# Altium schematic sheet Current_measure.SchDoc: Buck Sinc Converter
size A4; Organization: UDESC; Revision: R0; SheetNumber: 5; SheetTotal: 10
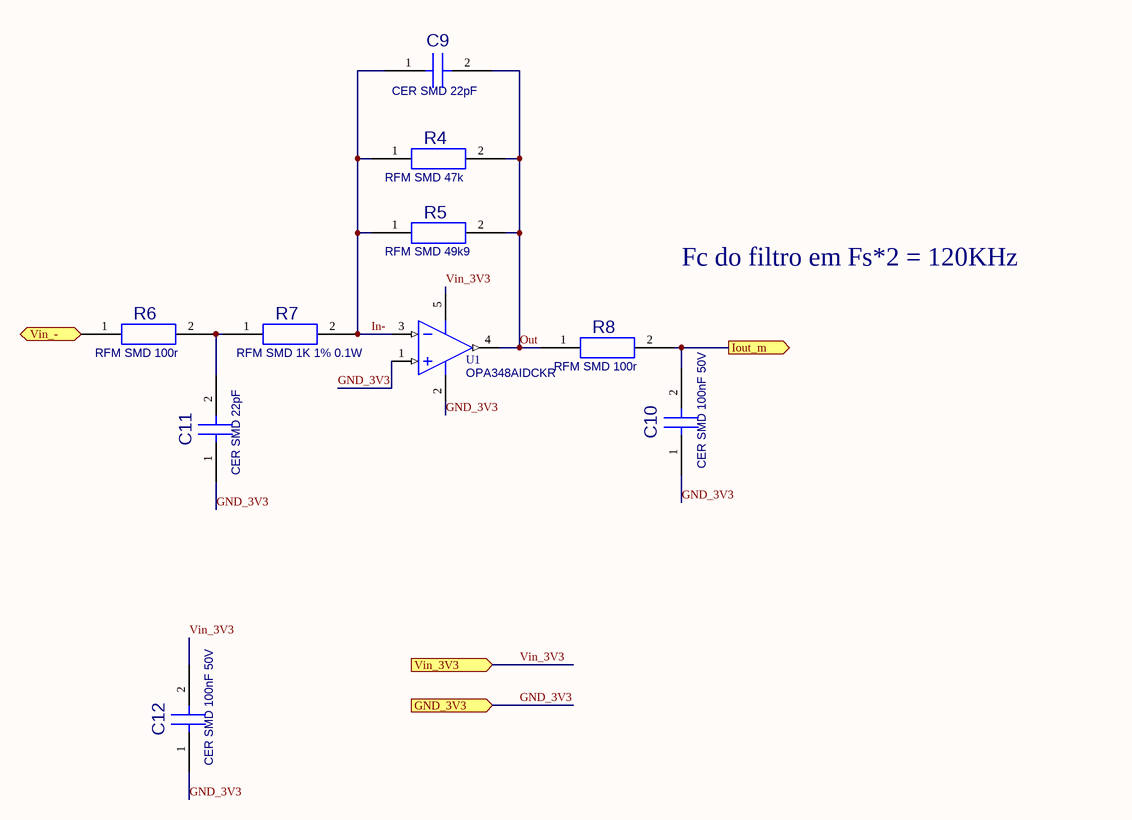
[diagram p0: Current_measure.SchDoc]

## Parts
C9  value CER SMD 22pF  [C0805_R_V0]  (hidden comment: 10192073)
C10  value CER SMD 100nF 50V  [C0805_R_V0]  (hidden comment: 10192075)
C11  value CER SMD 22pF  [C0805_R_V0]  (hidden comment: 10192073)
C12  value CER SMD 100nF 50V  [C0805_R_V0]  (hidden comment: 10192075)
R4  value RFM SMD 47k  [R0805_R_V0]  (hidden comment: 12314309)
R5  value RFM SMD 49k9  [R0805_R_V0]  (hidden comment: 10192018)
R6  value RFM SMD 100r  [R0805_R_V0]  (hidden comment: 10118083)
R7  value RFM SMD 1K 1% 0.1W  [R0805_R_V0]  (hidden comment: 10118077)
R8  value RFM SMD 100r  [R0805_R_V0]  (hidden comment: 10118083)
U1  OPA348AIDCKR  [DCK R-PDSO-G5]

## Ports
GND_3V3 (in), Iout_m (out), Vin_3V3 (in), Vin_- (in)

## Nets
GND_3V3: C10.1 C11.1 C12.1 U1.1(IN+) U1.2(V-) ; port GND_3V3
In-: C9.1 R4.1 R5.1 R7.2 U1.3(IN-)
Iout_m: C10.2 R8.2 ; port Iout_m
Out: C9.2 R4.2 R5.2 R8.1 U1.4(OUT)
Vin_3V3: C12.2 U1.5(V+) ; port Vin_3V3
Vin_-: R6.1 ; port Vin_-
NetC11_2: C11.2 R6.2 R7.1

## Notes on the sheet
- Fc do filtro em Fs*2 = 120KHz
- Title
- Size:
- Date:
- A4
- Number:
- Time:
- Revision:
- Sheet
- of
- File:

## Library data of the parts
C9 C11 = 10192075: CER SMD 22pF; HISsym: Atualizado em 12/07/05; TOL: 10%; ITEM BAAN: 0333.0044; PN: 10192073; PMT: SMD
C10 C12 = 10192075: CER SMD 100nF 50V; HISsym: Atualizado em 12/07/05; TOL: 10%; ITEM BAAN: 0333.0044; PN: 10192075; PMT: SMD
R4 = 10118077: RFM SMD 47k; HISsym: Atualizado em 20/07/05; PN: 12314309; PMT: SMD
R5 = 10118077: RFM SMD 49k9; HISsym: Atualizado em 20/07/05; PN: 10192018; PMT: SMD
R6 R8 = 10118077: RFM SMD 100r; HISsym: Atualizado em 20/07/05; PN: 10118083; PMT: SMD
R7 = 10118077: RFM SMD 1K 1% 0.1W; HISsym: Atualizado em 20/07/05; PN: 10118077; PMT: SMD
U1 = OPA348AIDCKR: 1 MHz, 45 uA, RRIO, Single Operational Amplifier, 2.1 to 5.5 V, -40 to 125 degC, 5-pin SOT23 (DCK5), Green (RoHS & no Sb/Br); Manufacturer: Texas Instruments; CMRR(Min)(dB): 70; GBW(Typ)(MHz): 1; IIB(Max)(pA): 10; Iq per channel(Max)(mA): 0.065; Offset Drift(Typ)(uV/C): 4; Packing: LARGE T&R; Rating: Catalog; Slew Rate(Typ)(V/us): 0.5; Sub Family: Low Input Bias Current Amp (<=10pA), Low Power Amp (<=500uA), Low Supply Voltage Amplifier (<=2.7V), Precision Amplifier; Total Supply Voltage(Max)(+5V is 5, +/-5V is 10): 5.5; Total Supply Voltage(Min)(+5V is 5, +/-5V is 10): 2.1; Vio (25C)(Max)(mV): 5; PN: 11354940; PMT: SMD; DatasheetVersion: SBOS213G; PackageVersion: 4093553-3/G, 01/2007; PackageReference: DCK5; PackageDescription: 5-Pin Plastic Small Outline, Body 2 x 1.25 mm, Pitch 0.65 mm; Supplier 1: Digi-Key; Supplier Part Number 1: 296-27989-2-ND; Supplier 2: Digi-Key; Supplier Part Number 2: 296-27989-1-ND; Supplier 3: Digi-Key; Supplier Part Number 3: 296-27989-6-ND; Supplier 4: Newark; Supplier Part Number 4: 86W6065; Supplier 5: Newark; Supplier Part Number 5: 75C4889; Supplier 6: Mouser; Supplier Part Number 6: 595-OPA348AIDCKR; Eco-Plan: Green (RoHS & no Sb/Br); Number of Channels: 1; Mounting Technology: Surface Mount; Code_JEDEC: MO-203; ComponentLink1Description: Manufacturer URL; ComponentLink1URL: http://www.ti.com/; ComponentLink2Description: Datasheet; ComponentLink2URL: http://www.ti.com/lit/ds/symlink/opa348.pdf; ComponentLink3Description: Package Specification; ComponentLink3URL: http://www.ti.com/litv/pdf/mpds025f; Value: OPA348AIDCKR